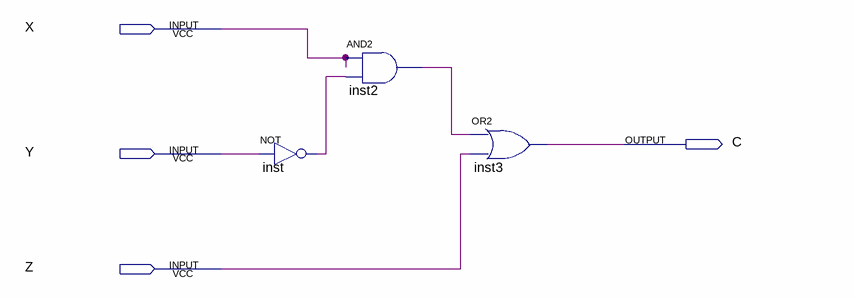
[diagram p0: schematic sheet]
// Quartus schematic Circuito-C.bdf as structural Verilog: 3 symbols, 4 pins
module \Circuito-C  (
  input  X,
  input  Y,
  input  Z,
  output C
);

  wire inst2_out, inst_out;

  not inst (inst_out, Y);
  and inst2 (inst2_out, X, inst_out);
  or inst3 (C, inst2_out, Z);
endmodule
